# Altium schematic sheet LDO.SchDoc
size A; SheetNumber: 5; SheetTotal: 15
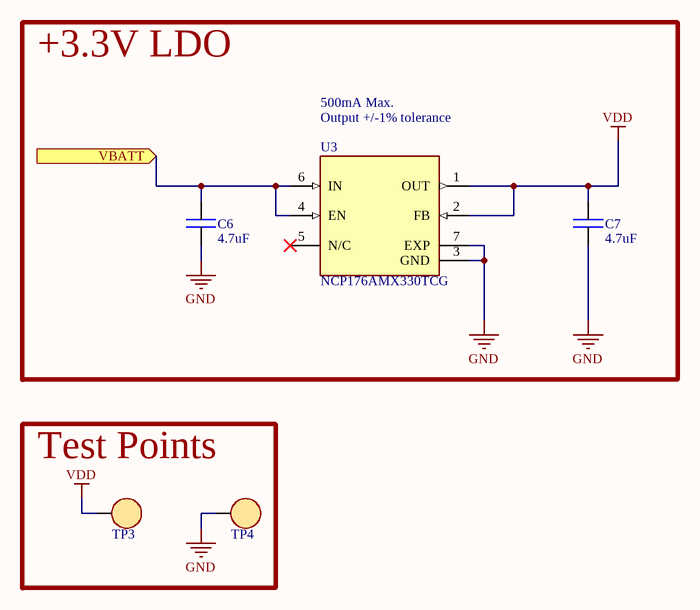
[diagram p0: LDO.SchDoc]

## Parts
C6  value 4.7uF  [0402C]  (hidden comment: CAP)
C7  value 4.7uF  [0402C]  (hidden comment: CAP)
TP3  RH-5019  [TP - RH-5019]  (value not drawn)
TP4  RH-5019  [TP - RH-5019]  (value not drawn)
U3  NCP176AMX330TCG  [6-XDFN]

## Blocks framed on the sheet
+3.3V LDO: C6 C7 U3
Test Points: TP3 TP4

## Ports
VBATT (in, see PressurePulse_Pulse-PCB_Master[5A], Fuel-Gauge[4B])

## Nets
GND: C6.1 C7.1 TP4.1 U3.3(GND) U3.7(EXP)
VDD: C7.2 TP3.1 U3.1(OUT) U3.2(FB)
VBATT: C6.2 U3.4(EN) U3.6(IN) ; port VBATT

Not connected (* = marked no-connect by the designer): U3 5(N/C)*

## Notes on the sheet
- 500mA Max.
- Output +/-1% tolerance

## Library data of the parts
C6 C7 = CAP: Capacitor; MFR: *; MFR PN: *; JLCPCB PN: *; Footprint: *
TP3 TP4 = TEST POINT: MFR: ronghe; MFR PN: RH-5019; Value: RH-5019; JLCPCB PN: C5199800
U3 = LDO 3.3V: LDO REGULATOR; MFR: onsemi; MFR PN: NCP176AMX330TCG; Value: NCP176AMX330TCG; JLCPCB PN: C233363